# Altium project SPINNER_TWIN_STARS.PrjPcb
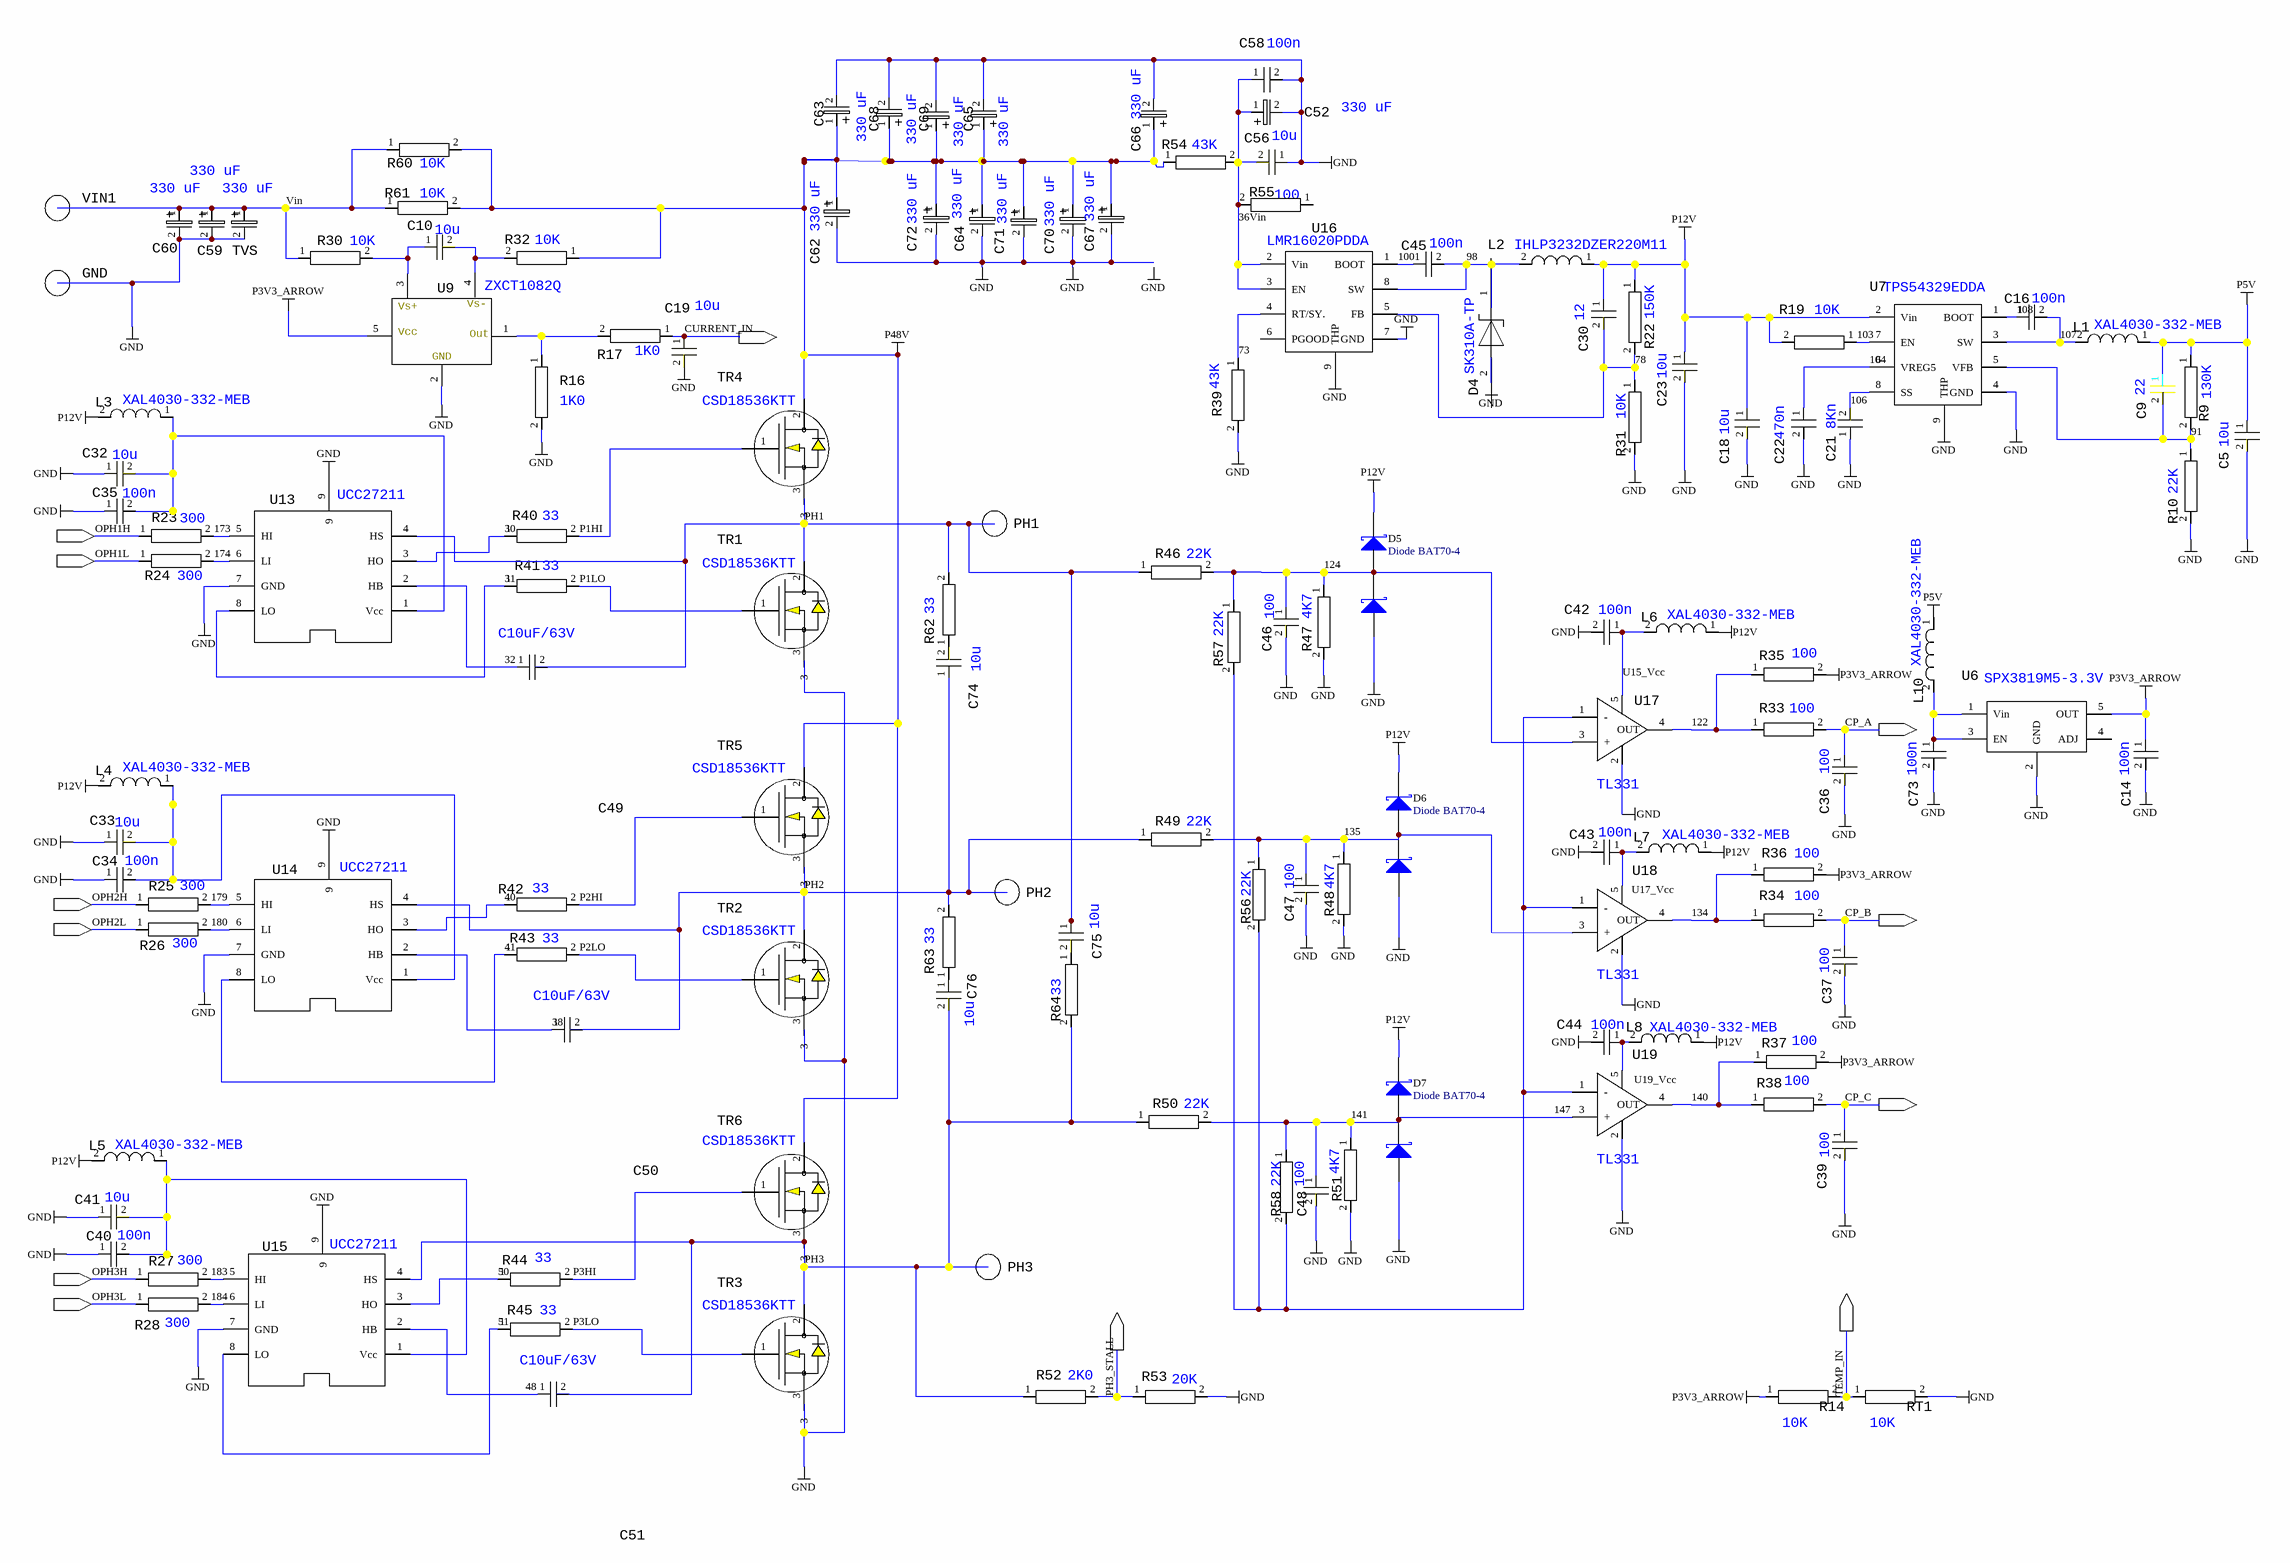
[diagram p0: POWER.SchDoc]
2 sheets, 226 parts. Net scope: global (net labels, ports and power ports of the same name join across sheets).
Board file: SPINNER_TWIN_STARS.PcbDoc
Sheets:
  POWER.SchDoc
  CONTROL.SchDoc

## Sheet POWER.SchDoc
size 533 x 330 mm

### Parts
(Parts that share a designator on the sheet are numbered #1, #2 ... from top to bottom, then left to right.)
?#1  SIGNALREF (externalout)  (value not drawn)  (graphical)
?#2  SIGNALREF (externalin)  (value not drawn)  (graphical)
?#3  SIGNALREF (externalin)  (value not drawn)  (graphical)
?#4  SIGNALREF (externalout)  (value not drawn)  (graphical)
?#5  SIGNALREF (externalin)  (value not drawn)  (graphical)
?#6  SIGNALREF (externalout)  (value not drawn)  (graphical)
?#7  SIGNALREF (externalin)  (value not drawn)  (graphical)
?#8  SIGNALREF (externalout)  (value not drawn)  (graphical)
?#9  SIGNALREF (externalin)  (value not drawn)  (graphical)
?#10  SIGNALREF (externalin)  (value not drawn)  (graphical)
?#11  SIGNALREF (externalout)  (value not drawn)  (graphical)
?#12  SIGNALREF (externalout)  (value not drawn)  (graphical)
C5  10u  [0805_N]
C9  22  [0805_N]
C10  10u  [0805_N]
C14  100n  [1608[0603]]
C16  100n  [1608[0603]]
C18  10u  [0805_N]
C19  10u  [0805_N]
C21  8Kn  [1608[0603]]
C22  470n  [0805_N]
C23  10u  [0805_N]
C30  12  [0805_N]
C32  10u  [0805_N]
C33  10u  [0805_N]
C34  100n  [1608[0603]]
C35  100n  [1608[0603]]
C36  100  [1608[0603]]
C37  100  [1608[0603]]
C39  100  [1608[0603]]
C40  100n  [1608[0603]]
C41  10u  [0805_N]
C42  100n  [1608[0603]]
C43  100n  [1608[0603]]
C44  100n  [1608[0603]]
C45  100n  [1608[0603]]
C46  100  [1608[0603]]
C47  100  [1608[0603]]
C48  100  [1608[0603]]
C49  C10uF/63V  [C1210_N]
C50  C10uF/63V  [C1210_N]
C51  C10uF/63V  [C1210_N]
C52  330 uF  [CAP  POLAR 10RM5 (wave)]
C56  10u  [0805_N]
C58  100n  [1608[0603]]
C59  330 uF  [CAP  POLAR 10RM5 (wave)]
C60  330 uF  [CAP  POLAR 10RM5 (wave)]
C62  330 uF  [CAP  POLAR 10RM5 (wave)]
C63  330 uF  [CAP  POLAR 10RM5 (wave)]
C64  330 uF  [CAP  POLAR 10RM5 (wave)]
C65  330 uF  [CAP  POLAR 10RM5 (wave)]
C66  330 uF  [CAP  POLAR 10RM5 (wave)]
C67  330 uF  [CAP  POLAR 10RM5 (wave)]
C68  330 uF  [CAP  POLAR 10RM5 (wave)]
C69  330 uF  [CAP  POLAR 10RM5 (wave)]
C70  330 uF  [CAP  POLAR 10RM5 (wave)]
C71  330 uF  [CAP  POLAR 10RM5 (wave)]
C72  330 uF  [CAP  POLAR 10RM5 (wave)]
C73  100n  [1608[0603]]
C74  10u  [0805_N]
C75  10u  [0805_N]
C76  10u  [0805_N]
D4  SK310A-TP
D5  Diode BAT70-4  [SOT-23_N]
D6  Diode BAT70-4  [SOT-23_N]
D7  Diode BAT70-4  [SOT-23_N]
GND  I-GAT 3.2/5 mm  [mec-hole3.2mm /5.0 MM]  (value not drawn)
L1  XAL4030-332-MEB
L2  IHLP3232DZER220M11  [3232DZ (3232)]
L3  XAL4030-332-MEB
L4  XAL4030-332-MEB
L5  XAL4030-332-MEB
L6  XAL4030-332-MEB
L7  XAL4030-332-MEB
L8  XAL4030-332-MEB
L10  XAL4030-332-MEB
PH1  I-GAT 3.2/5 mm  [mec-hole3.2mm /5.0 MM]  (value not drawn)
PH2  I-GAT 3.2/5 mm  [mec-hole3.2mm /5.0 MM]  (value not drawn)
PH3  I-GAT 3.2/5 mm  [mec-hole3.2mm /5.0 MM]  (value not drawn)
R9  130K  [1608[0603]]
R10  22K  [1608[0603]]
R14  10K  [1608[0603]]
R16  1K0  [1608[0603]]
R17  1K0  [1608[0603]]
R19  10K  [1608[0603]]
R22  150K  [1608[0603]]
R23  300  [1608[0603]]
R24  300  [1608[0603]]
R25  300  [1608[0603]]
R26  300  [1608[0603]]
R27  300  [1608[0603]]
R28  300  [1608[0603]]
R30  10K  [1608[0603]]
R31  10K  [1608[0603]]
R32  10K  [1608[0603]]
R33  100  [1608[0603]]
R34  100  [1608[0603]]
R35  100  [1608[0603]]
R36  100  [1608[0603]]
R37  100  [1608[0603]]
R38  100  [1608[0603]]
R39  43K  [1608[0603]]
R40  33  [0805_N]
R41  33  [0805_N]
R42  33  [0805_N]
R43  33  [0805_N]
R44  33  [0805_N]
R45  33  [0805_N]
R46  22K  [1608[0603]]
R47  4K7  [1608[0603]]
R48  4K7  [1608[0603]]
R49  22K  [1608[0603]]
R50  22K  [1608[0603]]
R51  4K7  [1608[0603]]
R52  2K0  [1608[0603]]
R53  20K  [1608[0603]]
R54  43K  [1608[0603]]
R55  100  [1608[0603]]
R56  22K  [1608[0603]]
R57  22K  [1608[0603]]
R58  22K  [1608[0603]]
R60  10K  [1608[0603]]
R61  10K  [1608[0603]]
R62  33  [0805_N]
R63  33  [0805_N]
R64  33  [0805_N]
RT1  10K  [1608[0603]]
TR1  CSD18536KTT  [TO-263 (D2PAK)]
TR2  CSD18536KTT  [TO-263 (D2PAK)]
TR3  CSD18536KTT  [TO-263 (D2PAK)]
TR4  CSD18536KTT  [TO-263 (D2PAK)]
TR5  CSD18536KTT  [TO-263 (D2PAK)]
TR6  CSD18536KTT  [TO-263 (D2PAK)]
TVS  330 uF  [CAP  POLAR 10RM5 (wave)]
U6  SPX3819M5-3.3V
U7  TPS54329EDDA  [S_SO8_POWER_PAD (wave)]
U9  ZXCT1082Q  [S_SOT23-5 (reflow)]
U13  UCC27211  [S_SO8_POWER_PAD (wave)]
U14  UCC27211  [S_SO8_POWER_PAD (wave)]
U15  UCC27211  [S_SO8_POWER_PAD (wave)]
U16  LMR16020PDDA  [S_SO8_POWER_PAD (wave)]
U17  TL331  [S_SOT23-5 (REFLOW)]
U18  TL331  [S_SOT23-5 (REFLOW)]
U19  TL331  [S_SOT23-5 (REFLOW)]
VIN1  I-GAT 3.2/5 mm  [mec-hole3.2mm /5.0 MM]  (value not drawn)

### Nets
GND: C5.2 C14.2 C18.2 C19.2 C21.1 C22.2 C23.2 C32.1 C33.1 C34.1 C35.1 C36.2 C37.2 C39.2 C40.1 C41.1 C42.2 C43.2 C44.2 C46.2 C47.2 C48.2 C52.2 C56.1 C58.2 C59.2 C60.2 C62.2 C63.2 C64.2 C65.2 C66.2 C67.2 C68.2 C69.2 C70.2 C71.2 C72.2 C73.2 D5.1(A) D6.1(A) D7.1(A) GND.1 R10.2 R16.2 R31.2 R39.2 R47.2 R48.2 R51.2 R53.2 RT1.2 TVS.2 U6.2(GND) U7.4(GND) U7.9(THP) U9.2 U13.7(GND) U13.9 U14.7(GND) U14.9 U15.7(GND) U15.9 U16.7(GND) U16.9(THP) U17.2(GND) U18.2(GND) U19.2(GND)
P3V3_ARROW: C14.1 R14.1 R35.2 R36.2 R37.2 U6.5(OUT) U9.5
P5V: C5.1 C9.1 L1.1 L10.1 R9.1
P12V: C18.1 C23.1 C30.1 D5.2(K) D6.2(K) D7.2(K) L2.1 L3.2 L4.2 L5.2 L6.1 L7.1 L8.1 R19.2 R22.1 U7.2(Vin)
P48V: C62.1 C63.1 C64.1 C65.1 C66.1 C67.1 C68.1 C69.1 C70.1 C71.1 C72.1 R32.1 R54.1 R60.2 R61.2 TR4.2 TR5.2 TR6.2
30: R40.1 U13.3(HO)
31: R41.1 U13.8(LO)
32: C49.1 U13.2(HB)
36Vin: C52.1 C56.2 C58.1 R54.2 R55.2 U16.2(Vin) U16.3(EN)
38: C50.1 U14.2(HB)
40: R42.1 U14.3(HO)
41: R43.1 U14.8(LO)
48: C51.1 U15.2(HB)
50: R44.1 U15.3(HO)
51: R45.1 U15.8(LO)
73: R39.1 U16.4(RT/SY.)
78: C30.2 R22.2 R31.1 U16.5(FB)
91: C9.2 R9.2 R10.1 U7.5(VFB)
98: C45.2 L2.2 U16.8(SW)
100: C45.1 U16.1(BOOT)
103: R19.1 U7.7(EN)
104: C22.1 U7.6(VREG5)
106: C21.2 U7.8(SS)
107: C16.2 L1.2 U7.3(SW)
108: C16.1 U7.1(BOOT)
122: R33.1 R35.1 U17.4(OUT)
124: C46.1 D5.3(KA) R46.2 R47.1 R57.1 U17.3(+)
134: R34.1 R36.1 U18.4(OUT)
135: C47.1 D6.3(KA) R48.1 R49.2 R56.1 U18.3(+)
140: R37.1 R38.1 U19.4(OUT)
141: C48.1 D7.3(KA) R50.2 R51.1 R58.1 U19.3(+)  [also labelled 147]
173: R23.2 U13.5(HI)
174: R24.2 U13.6(LI)
179: R25.2 U14.5(HI)
180: R26.2 U14.6(LI)
183: R27.2 U15.5(HI)
184: R28.2 U15.6(LI)
CP_A: ?#4.1 C36.1 R33.2
CP_B: ?#6.1 C37.1 R34.2
CP_C: ?#8.1 C39.1 R38.2
CURRENT_IN: ?#1.1 C19.1 R17.1
OPH1H: ?#2.1 R23.1
OPH1L: ?#3.1 R24.1
OPH2H: ?#5.1 R25.1
OPH2L: ?#7.1 R26.1
OPH3H: ?#9.1 R27.1
OPH3L: ?#10.1 R28.1
P1HI: R40.2 TR4.1
P1LO: R41.2 TR1.1
P2HI: R42.2 TR5.1
P2LO: R43.2 TR2.1
P3HI: R44.2 TR6.1
P3LO: R45.2 TR3.1
PH1: C49.2 C75.1 PH1.1 R46.1 R62.2 TR1.2 U13.4(HS)
PH2: C50.2 C74.1 PH2.1 R49.1 R63.2 TR2.2 U14.4(HS)
PH3: C51.2 C76.2 PH3.1 R50.1 R52.1 R64.2 TR3.2 U15.4(HS)
PH3_STALL: ?#12.1 R52.2 R53.1
TEMP_IN: ?#11.1 R14.2 RT1.1
U15_Vcc: C42.1 L6.2 U17.5(Vcc)
Vin: C59.1 C60.1 R30.1 R60.1 R61.1 TVS.1 VIN1.1
NetC10_1: C10.1 R30.2 U9.3
NetC10_2: C10.2 R32.2 U9.4
NetC32_2: C32.2 C35.2 L3.1 U13.1(Vcc)
NetC33_2: C33.2 C34.2 L4.1 U14.1(Vcc)
NetC40_2: C40.2 C41.2 L5.1 U15.1(Vcc)
NetC43_1: C43.1 L7.2 U18.5(Vcc)
NetC44_1: C44.1 L8.2 U19.5(Vcc)
NetC73_1: C73.1 L10.2 U6.1(Vin) U6.3(EN)
NetC74_2: C74.2 R62.1
NetC75_2: C75.2 R64.1
NetC76_1: C76.1 R63.1
NetR16_1: R16.1 R17.2 U9.1
NetR56_2: R56.2 R57.2 R58.2 U17.1(-) U18.1(-) U19.1(-)

Not connected (* = marked no-connect by the designer): D4 1 2; R55 1; TR1 3; TR2 3; TR3 3; TR4 3; TR5 3; TR6 3; U6 4(ADJ); U16 6(PGOOD)

### Notes on the sheet
- Labels drawn without touching a wire or pin: GND, U17_Vcc, U19_Vcc
- (in symbol ZXCT1082Q) Vs+; Vs-; Vcc; Out; GND

### Library data of the parts
C5 C10 C18 C19 C23 C32 C33 C41 C56 C74-C76 = C10u-10%-0805: 10u Surface mount CAP 0805 10% 25V; (OldCtfName): (CTF_OLD_NAME_INVALID); Value: 10u; Tolerance: 10%; Voltage: 25V
C9 = C22-10%-0805: 22p Surface mount CAP 10% 25V; (OldCtfName): (CTF_OLD_NAME_INVALID); Value: 22; Tolerance: 10%; Voltage: 25V
C14 C16 C34 C35 C40 C42-C45 C58 C73 = C100n-10%-0603: 100n Surface mount CAP 10% 25V; (OldCtfName): (CTF_OLD_NAME_INVALID); Value: 100n; Tolerance: 10%; Voltage: 25V
C21 = C8n2-10%-0603: 8n2 Surface mount CAP 10% 25V; (OldCtfName): (CTF_OLD_NAME_INVALID); Value: 8Kn; Tolerance: 10%; Voltage: 25V
C22 = C470n-10%-0805: 470n Surface mount CAP 10% 25V; (OldCtfName): (CTF_OLD_NAME_INVALID); Value: 470n; Tolerance: 10%; Voltage: 25V
C30 = C12-10%-0805: 12p Surface mount CAP 10% 25V; (OldCtfName): (CTF_OLD_NAME_INVALID); Value: 12; Tolerance: 10%; Voltage: 25V
C36 C37 C39 C46-C48 = C100-10%-0603: 100p Surface mount CAP 10% 25V; (OldCtfName): (CTF_OLD_NAME_INVALID); Value: 100; Tolerance: 10%; Voltage: 25V
C49-C51 = C10uF/63V-1210: SURFACE MOUNT CAPACITOR; Voltage: 63V; Tolerance: 20%; (OldCtfName): (CTF_OLD_NAME_INVALID); Value: C10uF/63V
C52 C59 C60 C62-C72 TVS = C330uF-63V--Polar: Voltage: 63V; Tolerance: 20%; (OldCtfName): (CTF_OLD_NAME_INVALID); Value: 330 uF
D4 = SK310A-TP: SHOTTKY DIODE 100V/3A; Manufacturer: MCC; (OldCtfName): (CTF_OLD_NAME_INVALID); Value: SK310A-TP
D5-D7 = Diode BAS70-04: Silicon RF Schottky Diode for Mixer Applications in the VHF/UHF Range; Note: Pin 2 is not connected and not drawn.; Published: 21-Mar-2003; LatestRevisionDate: 29-May-2009; LatestRevisionNote: IPC-7351 Footprint Added.; DatasheetVersion: Oct-1999; PackageVersion: Sep-2001; PackageReference: SOT-23; Publisher: Altium Limited; PackageDescription: 3-Pin SOT-23 Package 0.95 mm Pitch, 2.5 mm Lead Span; ComponentLink1Description: Manufacturer Link; ComponentLink1URL: http://www.infineon.com/; ComponentLink2Description: Datasheet; ComponentLink2URL: http://www.infineon.com/upload/Document/cmc_upload/documents/009/363/bat17series.pdf
GND PH1-PH3 VIN1 = I-GAT 3.2/5 mm: Hole Plated 3.2 mm x 5 mm; (OldCtfName): (CTF_OLD_NAME_INVALID)
L1 L3-L8 L10 = XAL4030-332-MEB: XAL4030-332-MEB - INDUCTOR 33 uH; Tolerance: 20%; (OldCtfName): (CTF_OLD_NAME_INVALID); Value: XAL4030-332-MEB; Elec_type: XAL4030-332-MEB
L2 = IHLP3232DZER220M11: IHLP3232DZER220M11- 22 uH; Tolerance: 20%; (OldCtfName): (CTF_OLD_NAME_INVALID); Value: IHLP3232DZER220M11; Elec_type: IHLP3232DZER220M11
R9 = R130K-1%-0805: 130K SMD 0805 1%; Wattage: 0.25W; (OldCtfName): (CTF_OLD_NAME_INVALID); Value: 130K; Tolerance: 1%
R10 R46 R49 R50 R56-R58 = R22K-1%-0603: 22K SMD 0603 1%; Wattage: 0.065W; (OldCtfName): (CTF_OLD_NAME_INVALID); Value: 22K; Tolerance: 1%
R14 R19 R30-R32 R60 R61 RT1 = R10K-1%-0603: 10K SMD 0603 1%; Wattage: 0.065W; (OldCtfName): (CTF_OLD_NAME_INVALID); Value: 10K; Tolerance: 1%
R16 R17 = R1K0-1%-0603: 1K0 SMD 0603 1%; Wattage: 0.065W; (OldCtfName): (CTF_OLD_NAME_INVALID); Value: 1K0; Tolerance: 1%
R22 = R150K-1%-0805: 150K SMD 0805 1%; Wattage: 0.25W; (OldCtfName): (CTF_OLD_NAME_INVALID); Value: 150K; Tolerance: 1%
R23-R28 = R300-1%-0603: 300R SMD 0603 1%; Wattage: 0.065W; (OldCtfName): (CTF_OLD_NAME_INVALID); Value: 300; Tolerance: 1%
R33-R38 R55 = R100-1%-0603: 100R SMD 0603 1%; Wattage: 0.065W; (OldCtfName): (CTF_OLD_NAME_INVALID); Value: 100; Tolerance: 1%
R39 R54 = R43K-1%-0603: 43K SMD 0603 1%; Wattage: 0.065W; (OldCtfName): (CTF_OLD_NAME_INVALID); Value: 43K; Tolerance: 1%
R40-R45 R62-R64 = R33-1%-0805: 33R SMD 0805 1%; Wattage: 0.25W; (OldCtfName): (CTF_OLD_NAME_INVALID); Value: 33; Tolerance: 1%
R47 R48 R51 = R4K7-1%-0603: 4K7 SMD 0603 1%; Wattage: 0.065W; (OldCtfName): (CTF_OLD_NAME_INVALID); Value: 4K7; Tolerance: 1%
R52 = R2K0-1%-0603: 2K0 SMD 0603 1%; Wattage: 0.065W; (OldCtfName): (CTF_OLD_NAME_INVALID); Value: 2K0; Tolerance: 1%
R53 = R20K-1%-0603: 20K SMD 0603 1%; Wattage: 0.065W; (OldCtfName): (CTF_OLD_NAME_INVALID); Value: 20K; Tolerance: 1%
TR1-TR6 = CSD18536KTT: N-CHANNEL MOSFET DPAK; Manufacturer: TI; (OldCtfName): (CTF_OLD_NAME_INVALID); Value: CSD18536KTT
U6 = SPX1819M5-3.3V: POS VOLTAGE REGULATOR FIXED 3.3V; Manufacturer: EXAR; (OldCtfName): (CTF_OLD_NAME_INVALID); Value: SPX3819M5-3.3V
U7 = TPS54329EDDA: POS STEP DOWN CONVERTER ADJUSTABLE; Manufacturer: TI; (OldCtfName): (CTF_OLD_NAME_INVALID); Value: TPS54329EDDA
U9 = ZXCT1082Q: CURRENT MIRROR ZXCT1082Q; Manufacturer: DIODES Inc; (OldCtfName): (CTF_OLD_NAME_INVALID); Value: ZXCT1082Q
U13-U15 = UCC27211: DOUBLE MOSFET DRIVED; Manufacturer: TI; (OldCtfName): (CTF_OLD_NAME_INVALID); Value: UCC27211
U16 = LMR16020PDDA: POS STEP DOWN CONVERTER ADJUSTABLE; Manufacturer: TI; (OldCtfName): (CTF_OLD_NAME_INVALID); Value: LMR16020PDDA
U17-U19 = TL331: RAIL-TO-RAIL COMPARATOR; Manufacturer: ANALOG DEVICES; (OldCtfName): (CTF_OLD_NAME_INVALID); Value: TL331

## Sheet CONTROL.SchDoc
size A3
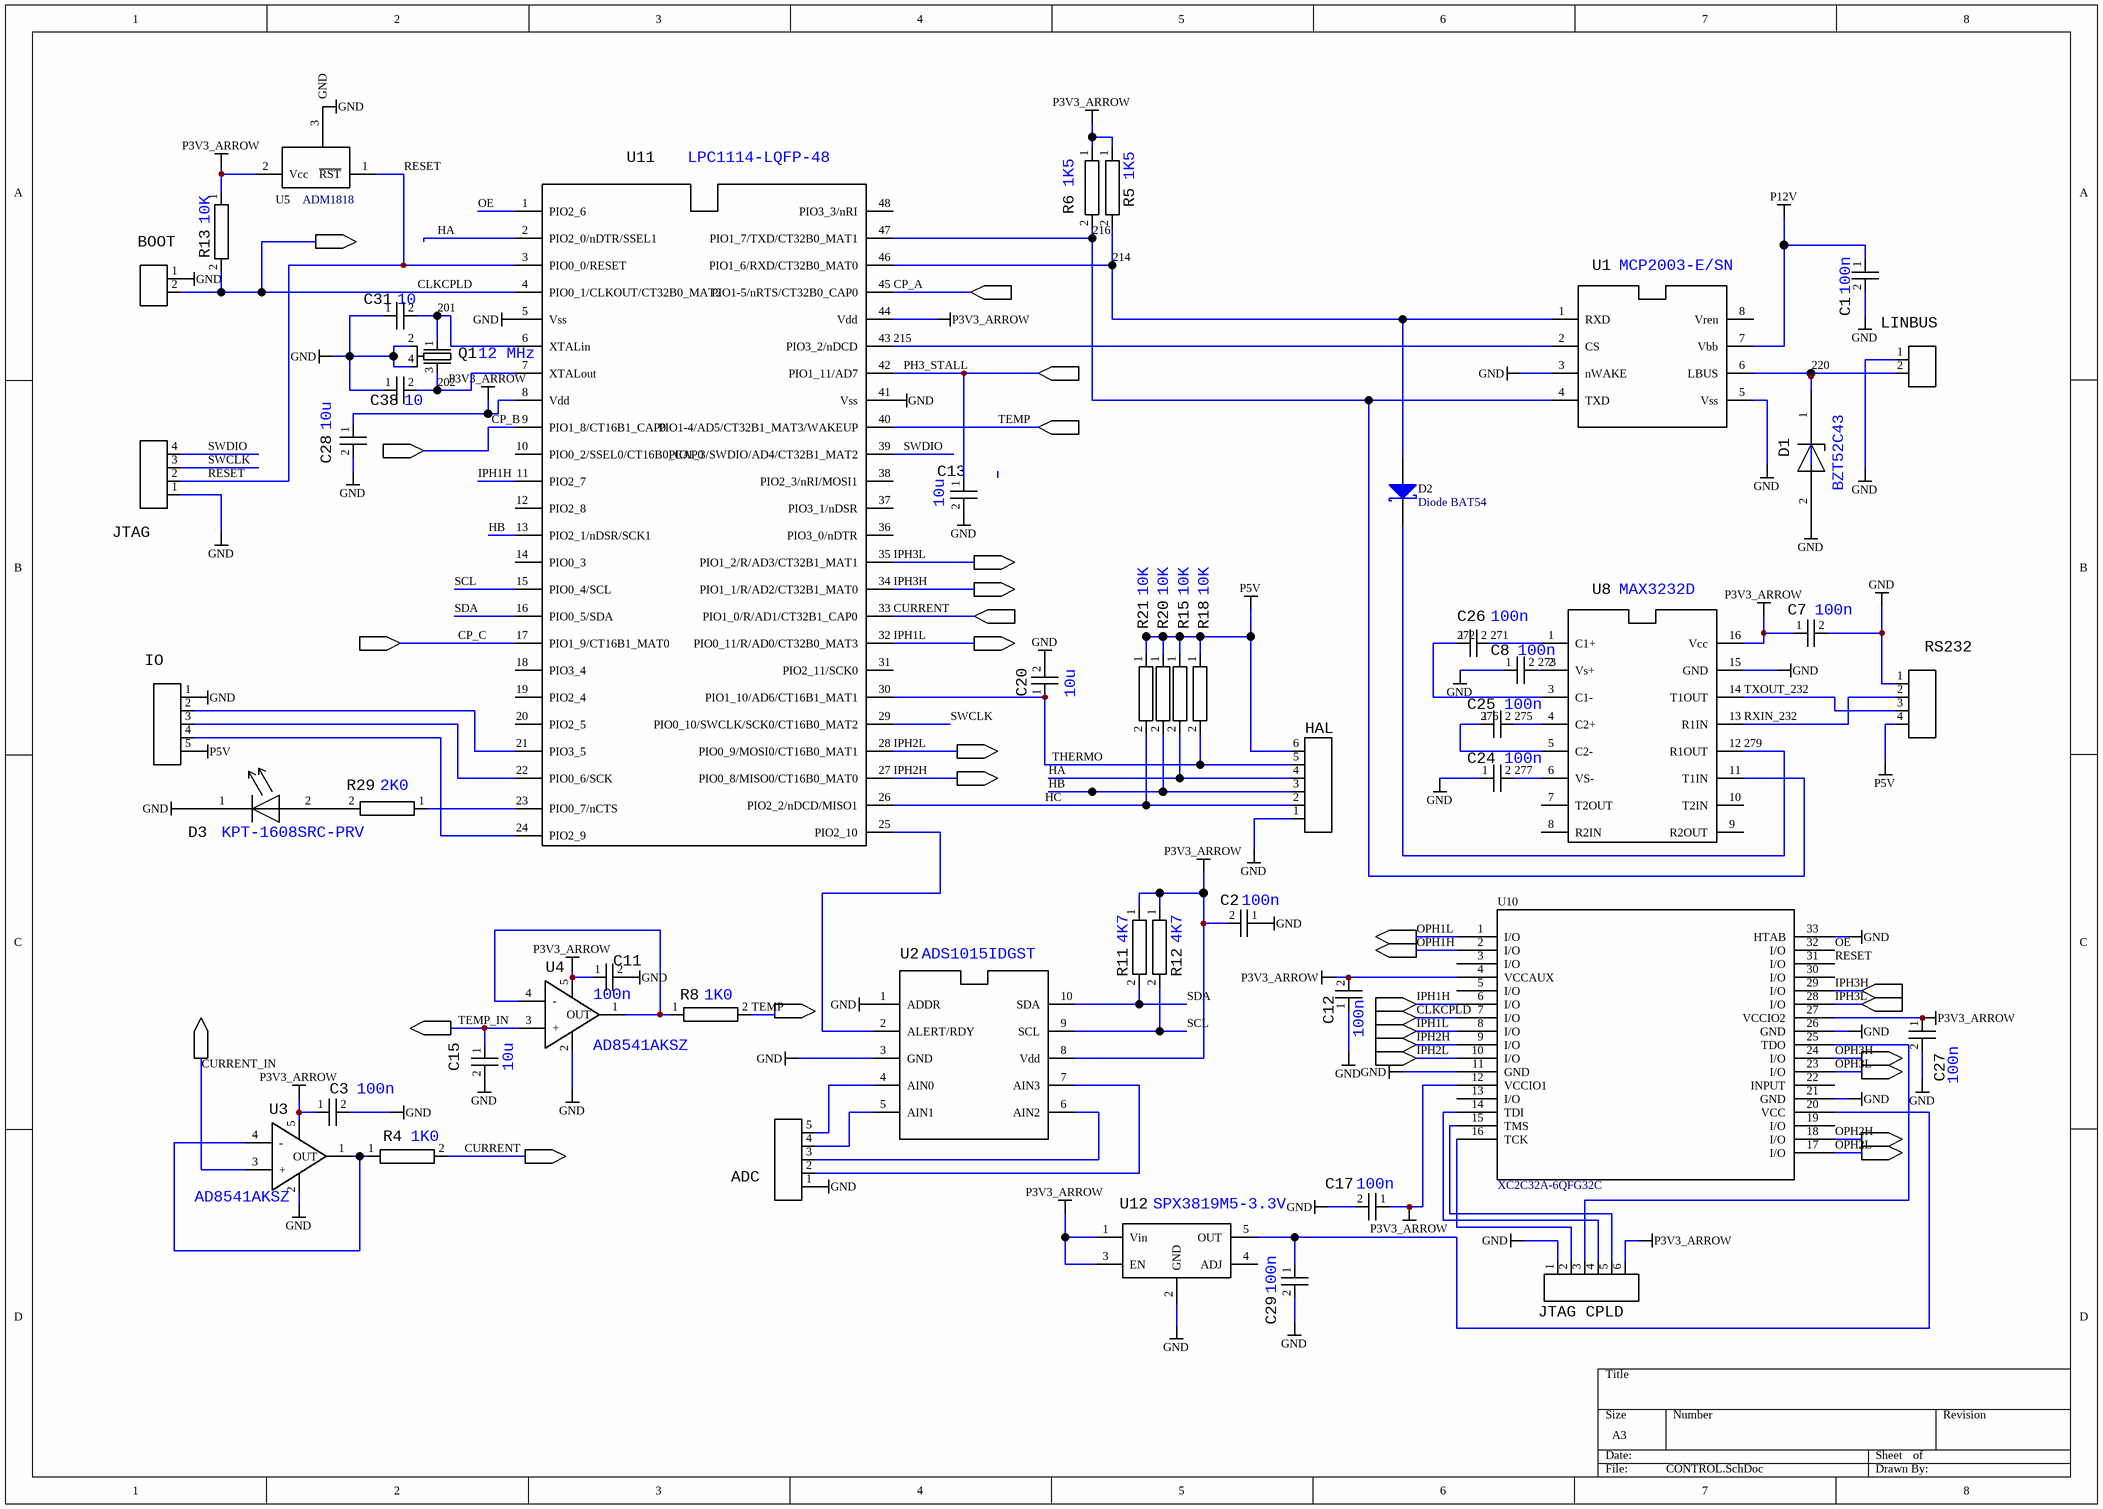
[diagram p1: CONTROL.SchDoc]

### Parts
(Parts that share a designator on the sheet are numbered #1, #2 ... from top to bottom, then left to right.)
?#13  SIGNALREF (externalout)  (value not drawn)  (graphical)
?#14  SIGNALREF (externalin)  (value not drawn)  (graphical)
?#15  SIGNALREF (externalin)  (value not drawn)  (graphical)
?#16  SIGNALREF (externalin)  (value not drawn)  (graphical)
?#17  SIGNALREF (externalin)  (value not drawn)  (graphical)
?#18  SIGNALREF (externalout)  (value not drawn)  (graphical)
?#19  SIGNALREF (externalout)  (value not drawn)  (graphical)
?#20  SIGNALREF (externalin)  (value not drawn)  (graphical)
?#21  SIGNALREF (externalin)  (value not drawn)  (graphical)
?#22  SIGNALREF (externalout)  (value not drawn)  (graphical)
?#23  SIGNALREF (externalout)  (value not drawn)  (graphical)
?#24  SIGNALREF (externalout)  (value not drawn)  (graphical)
?#25  SIGNALREF (externalin)  (value not drawn)  (graphical)
?#26  SIGNALREF (externalin)  (value not drawn)  (graphical)
?#27  SIGNALREF (externalin)  (value not drawn)  (graphical)
?#28  SIGNALREF (externalin)  (value not drawn)  (graphical)
?#29  SIGNALREF (externalin)  (value not drawn)  (graphical)
?#30  SIGNALREF (externalout)  (value not drawn)  (graphical)
?#31  SIGNALREF (externalin)  (value not drawn)  (graphical)
?#32  SIGNALREF (externalout)  (value not drawn)  (graphical)
?#33  SIGNALREF (externalin)  (value not drawn)  (graphical)
?#34  SIGNALREF (externalin)  (value not drawn)  (graphical)
?#35  SIGNALREF (externalout)  (value not drawn)  (graphical)
?#36  SIGNALREF (externalin)  (value not drawn)  (graphical)
?#37  SIGNALREF (externalin)  (value not drawn)  (graphical)
?#38  SIGNALREF (externalin)  (value not drawn)  (graphical)
?#39  SIGNALREF (externalin)  (value not drawn)  (graphical)
?#40  SIGNALREF (externalout)  (value not drawn)  (graphical)
?#41  SIGNALREF (externalin)  (value not drawn)  (graphical)
ADC  HEADER 5P S MALE  [CON-SRS-5-0254]  (value not drawn)
BOOT  HEADER 2P S MALE  [con-srs-2-0254]  (value not drawn)
C1  100n  [1608[0603]]
C2  100n  [1608[0603]]
C3  100n  [1608[0603]]
C7  100n  [1608[0603]]
C8  100n  [1608[0603]]
C11  100n  [1608[0603]]
C12  100n  [1608[0603]]
C13  10u  [0805_N]
C15  10u  [0805_N]
C17  100n  [1608[0603]]
C20  10u  [0805_N]
C24  100n  [1608[0603]]
C25  100n  [1608[0603]]
C26  100n  [1608[0603]]
C27  100n  [1608[0603]]
C28  10u  [0805_N]
C29  100n  [1608[0603]]
C31  10  [1608[0603]]
C38  10  [1608[0603]]
D1  BZT52C43  [SOD123]
D2  Diode BAT54  [SOT-23_N]
D3  KPT-1608SRC-PRV
HAL  HEADER 6P S MALE  [con-srs-6-0254]  (value not drawn)
IO  HEADER 5P S MALE  [CON-SRS-5-0254]  (value not drawn)
JTAG  HEADER 4P S MALE  [con-srs-4-0254]  (value not drawn)
JTAG_CPLD  HEADER 6P S MALE  [con-srs-6-0254]  (value not drawn)
LINBUS  HEADER 2P S MALE  [con-srs-2-0254]  (value not drawn)
Q1  12 MHz  [QUARTZ SMD QKT (QKT)]
R4  1K0  [1608[0603]]
R5  1K5  [1608[0603]]
R6  1K5  [1608[0603]]
R8  1K0  [1608[0603]]
R11  4K7  [1608[0603]]
R12  4K7  [1608[0603]]
R13  10K  [1608[0603]]
R15  10K  [1608[0603]]
R18  10K  [1608[0603]]
R20  10K  [1608[0603]]
R21  10K  [1608[0603]]
R29  2K0  [1608[0603]]
RS232  HEADER 4P S MALE  [con-srs-4-0254]  (value not drawn)
U1  MCP2003-E/SN
U2  ADS1015IDGST  [VSSOP-10 (GST)]
U3  AD8541AKSZ
U4  AD8541AKSZ
U5  ADM1818  [SOT-23_N]
U8  MAX3232D
U10  XC2C32A-6QFG32C  [32-QFN]
U11  LPC1114-LQFP-48  [LQFP48_N]
U12  SPX3819M5-3.3V

### Nets
GND: ADC.1 BOOT.1 C1.2 C2.1 C3.2 C7.2 C8.1 C11.2 C12.1 C13.2 C15.2 C17.2 C20.2 C24.1 C27.2 C28.2 C29.2 C31.1 C38.1 D3.1 HAL.1 IO.1 JTAG.1 JTAG_CPLD.1 LINBUS.1 Q1.2 Q1.4 RS232.1 U1.3(nWAKE) U1.5(Vss) U2.1(ADDR) U2.3(GND) U3.2(GND) U4.2(GND) U8.15(GND) U10.11(GND) U10.21(GND) U10.26(GND) U10.33(HTAB) U11.5(Vss) U11.41(Vss) U12.2(GND)
P3V3_ARROW: C2.2 C3.1 C7.1 C11.1 C12.2 C17.1 C27.1 C28.1 JTAG_CPLD.6 R5.1 R6.1 R11.1 R12.1 R13.1 U2.8(Vdd) U3.5(Vcc) U4.5(Vcc) U5.2(Vcc) U8.16(Vcc) U10.4(VCCAUX) U10.12(VCCIO1) U10.27(VCCIO2) U11.8(Vdd) U11.44(Vdd) U12.1(Vin) U12.3(EN)
P5V: HAL.6 IO.5 R15.1 R18.1 R20.1 R21.1 RS232.4
P12V: C1.1 U1.7(Vbb)
201: C31.2 Q1.1 U11.6(XTALin)
202: C38.2 Q1.3 U11.7(XTALout)
214: D2.1(A) R5.2 U1.1(RXD) U11.46(PIO1_6/RXD/CT32B0_MAT0)
215: U1.2(CS) U11.43(PIO3_2/nDCD)
216: R6.2 U1.4(TXD) U8.11(T1IN) U11.47(PIO1_7/TXD/CT32B0_MAT1)
220: D1.1 LINBUS.2 U1.6(LBUS)
271: C26.2 U8.1(C1+)
272: C26.1 U8.3(C1-)
273: C8.2 U8.2(Vs+)
275: C25.2 U8.4(C2+)
276: C25.1 U8.5(C2-)
277: C24.2 U8.6(VS-)
279: D2.3(K) U8.12(R1OUT)
CLKCPLD: ?#13.1 ?#31.1 BOOT.2 R13.2 U10.7(I/O) U11.4(PIO0_1/CLKOUT/CT32B0_MAT2)
CP_A: ?#14.1 U11.45(PIO1-5/nRTS/CT32B0_CAP0)
CP_B: ?#17.1 U11.9(PIO1_8/CT16B1_CAP0)
CP_C: ?#21.1 U11.17(PIO1_9/CT16B1_MAT0)
CURRENT: ?#20.1 ?#40.1 R4.2 U11.33(PIO1_0/R/AD1/CT32B1_CAP0)
CURRENT_IN: ?#35.1 U3.3(+)
HA: HAL.4 R15.2 U11.2(PIO2_0/nDTR/SSEL1)
HB: HAL.3 R20.2 U11.13(PIO2_1/nDSR/SCK1)
HC: HAL.2 R21.2 U11.26(PIO2_2/nDCD/MISO1)
IPH1H: ?#28.1 U10.6(I/O) U11.11(PIO2_7)
IPH1L: ?#22.1 ?#33.1 U10.8(I/O) U11.32(PIO0_11/R/AD0/CT32B0_MAT3)
IPH2H: ?#24.1 ?#34.1 U10.9(I/O) U11.27(PIO0_8/MISO0/CT16B0_MAT0)
IPH2L: ?#23.1 ?#36.1 U10.10(I/O) U11.28(PIO0_9/MOSI0/CT16B0_MAT1)
IPH3H: ?#19.1 ?#27.1 U10.29(I/O) U11.34(PIO1_1/R/AD2/CT32B1_MAT0)
IPH3L: ?#18.1 ?#29.1 U10.28(I/O) U11.35(PIO1_2/R/AD3/CT32B1_MAT1)
OE: U10.32(I/O) U11.1(PIO2_6)
OPH1H: U10.2(I/O)
OPH1L: U10.1(I/O)
OPH2H: U10.18(I/O)
OPH2L: U10.17(I/O)
OPH3H: U10.24(I/O)
OPH3L: U10.23(I/O)
PH3_STALL: ?#15.1 C13.1 U11.42(PIO1_11/AD7)
RESET: JTAG.2 U5.1(~{RST}) U10.31(I/O) U11.3(PIO0_0/RESET)
RXIN_232: RS232.2 U8.13(R1IN)
SCL: R12.2 U2.9(SCL) U11.15(PIO0_4/SCL)
SDA: R11.2 U2.10(SDA) U11.16(PIO0_5/SDA)
SWCLK: JTAG.3 U11.29(PIO0_10/SWCLK/SCK0/CT16B0_MAT2)
SWDIO: JTAG.4 U11.39(PIO1_3/SWDIO/AD4/CT32B1_MAT2)
TEMP: ?#16.1 ?#30.1 R8.2 U11.40(PIO1-4/AD5/CT32B1_MAT3/WAKEUP)
TEMP_IN: ?#32.1 C15.1 U4.3(+)
THERMO: C20.1 HAL.5 R18.2 U11.30(PIO1_10/AD6/CT16B1_MAT1)
TXOUT_232: RS232.3 U8.14(T1OUT)
NetADC_2: ADC.2 U2.7(AIN3)
NetADC_3: ADC.3 U2.6(AIN2)
NetADC_4: ADC.4 U2.5(AIN1)
NetADC_5: ADC.5 U2.4(AIN0)
NetC29_1: C29.1 U10.20(VCC) U12.5(OUT)
NetD3_2: D3.2 R29.2
NetIO_2: IO.2 U11.21(PIO3_5)
NetIO_3: IO.3 U11.22(PIO0_6/SCK)
NetIO_4: IO.4 U11.24(PIO2_9)
NetJTAG_CPLD_2: JTAG_CPLD.2 U10.16(TCK)
NetJTAG_CPLD_3: JTAG_CPLD.3 U10.25(TDO)
NetJTAG_CPLD_4: JTAG_CPLD.4 U10.14(TDI)
NetJTAG_CPLD_5: JTAG_CPLD.5 U10.15(TMS)
NetR4_1: R4.1 U3.1(OUT) U3.4(-)
NetR8_1: R8.1 U4.1(OUT) U4.4(-)
NetR29_1: R29.1 U11.23(PIO0_7/nCTS)
NetU2_2: U2.2(ALERT/RDY) U11.25(PIO2_10)

Not connected (* = marked no-connect by the designer): ?#25 1; ?#26 1; ?#37 1; ?#38 1; ?#39 1; ?#41 1; D1 2; U1 8(Vren); U5 3(GND); U8 7(T2OUT) 8(R2IN) 9(R2OUT) 10(T2IN); U10 3(I/O) 5(I/O) 13(I/O) 19(I/O) 22(INPUT) 30(I/O); U11 10(PIO0_2/SSEL0/CT16B0_CAP0) 12(PIO2_8) 14(PIO0_3) 18(PIO3_4) 19(PIO2_4) 20(PIO2_5) 31(PIO2_11/SCK0) 36(PIO3_0/nDTR) 37(PIO3_1/nDSR) 38(PIO2_3/nRI/MOSI1) 48(PIO3_3/nRI); U12 4(ADJ)

### Notes on the sheet
- Labels drawn without touching a wire or pin: GND

### Library data of the parts
ADC IO = HEADER 5P S MALE: HEADER SINGLE ROW 4P STRAIGHT MALE; Elec_type: ON_BOARD_CONNECTOR; (OldCtfName): (CTF_OLD_NAME_INVALID)
BOOT LINBUS = HEADER 2P S MALE: HEADER SINGLE ROW 2P STRAIGHT MALE; Elec_type: ON_BOARD_CONNECTOR; (OldCtfName): (CTF_OLD_NAME_INVALID)
C1-C3 C7 C8 C11 C12 C17 C24-C27 C29 = C100n-10%-0603: as C14 on sheet POWER; Value: 100n; Tolerance: 10%; Voltage: 25V
C13 C15 C20 C28 = C10u-10%-0805: as C5 on sheet POWER; Value: 10u; Tolerance: 10%; Voltage: 25V
C31 C38 = C10-10%-0603: 10p Surface mount CAP 10% 25V; (OldCtfName): (CTF_OLD_NAME_INVALID); Value: 10; Tolerance: 10%; Voltage: 25V
D1 = BZT52C43: ZENER DIODE 43V; Manufacturer: DIODES; (OldCtfName): (CTF_OLD_NAME_INVALID); Value: BZT52C43
D2 = Diode BAT17: Silicon RF Schottky Diode for Mixer Applications in the VHF/UHF Range; Note: Pin 2 is not connected and not drawn.; Published: 21-Mar-2003; LatestRevisionDate: 29-May-2009; LatestRevisionNote: IPC-7351 Footprint Added.; DatasheetVersion: Oct-1999; PackageVersion: Sep-2001; PackageReference: SOT-23; Publisher: Altium Limited; PackageDescription: 3-Pin SOT-23 Package 0.95 mm Pitch, 2.5 mm Lead Span; ComponentLink1Description: Manufacturer Link; ComponentLink1URL: http://www.infineon.com/; ComponentLink2Description: Datasheet; ComponentLink2URL: http://www.infineon.com/upload/Document/cmc_upload/documents/009/363/bat17series.pdf
D3 = KPT-1608SRC-PRV: LED SMD RED        0603; Manufacturer: KINGBRIGHT; (OldCtfName): (CTF_OLD_NAME_INVALID); Value: KPT-1608SRC-PRV
HAL JTAG_CPLD = HEADER 6P S MALE: HEADER SINGLE ROW 6P STRAIGHT MALE; Elec_type: ON_BOARD_CONNECTOR; (OldCtfName): (CTF_OLD_NAME_INVALID)
JTAG RS232 = HEADER 4P S MALE: HEADER SINGLE ROW 4P STRAIGHT MALE; Elec_type: ON_BOARD_CONNECTOR; (OldCtfName): (CTF_OLD_NAME_INVALID)
Q1 = Q-12MHz-QKT_SMD: Quartz resonator QKT SMD case; (OldCtfName): (CTF_OLD_NAME_INVALID); Value: 12 MHz
R4 R8 = R1K0-1%-0603: as R16 on sheet POWER; Value: 1K0; Tolerance: 1%
R5 R6 = R1K5-1%-0805: 1K5 SMD 0805 1%; Wattage: 0.25W; (OldCtfName): (CTF_OLD_NAME_INVALID); Value: 1K5; Tolerance: 1%
R11 R12 = R4K7-1%-0603: as R47 on sheet POWER; Value: 4K7; Tolerance: 1%
R13 R15 R18 R20 R21 = R10K-1%-0603: as R14 on sheet POWER; Value: 10K; Tolerance: 1%
R29 = R2K0-1%-0603: as R52 on sheet POWER; Value: 2K0; Tolerance: 1%
U1 = MCP2003-E/SN: LIN DRIVER; Manufacturer: MICROCHIP; (OldCtfName): (CTF_OLD_NAME_INVALID); Value: MCP2003-E/SN
U2 = ADS1015IDGST: 4 CHAN AD CONVERTER; Manufacturer: TI; (OldCtfName): (CTF_OLD_NAME_INVALID); Value: ADS1015IDGST
U3 U4 = AD8541AKSZ: RAIL-TO-RAIL OPERATIONAL AMP; Manufacturer: ANALOG DEVICES; (OldCtfName): (CTF_OLD_NAME_INVALID); Value: AD8541AKSZ
U5 = ADM1818: MCU Reset IC; Note: Pin 2 is not connected and not drawn.; PackageVersion: Sep-2001; PackageReference: SOT-23; PackageDescription: 3-Pin SOT-23 Package 0.95 mm Pitch, 2.5 mm Lead Span; Published: 21-Mar-2003; LatestRevisionDate: 29-May-2009; LatestRevisionNote: IPC-7351 Footprint Added.; DatasheetVersion: Oct-1999
U8 = MAX232D: RS-232 TRANSCEIVER; Manufacturer: TEXAS; thm_power_diss: 0.2275; (OldCtfName): (CTF_OLD_NAME_INVALID); Value: MAX3232D
U10 = XC2C32A-6QFG32C: Imported; Vendor: Xilinx Inc; Programmable_Type: In System Programmable; Number_of_Macrocells: 32; Number_of_I_/O: 21; Operating_Temperature: 0Â°C ~ 70Â°C; Names_Registered_&amp;_Trademark_Names: CoolRunner II; Voltage: 1.8V; Memory_Type: CMOS; Delay_Time_tpd(1)_Max: 5.5ns; Voltage_Supply_-_Internal: 1.7 V ~ 1.9 V; Number_of_Logic_Elements/Blocks: 2; Number_of_Gates: 750; Mounting_Type: Surface Mount; C: Copyright (C) 2015 Accelerated Designs. All rights reserved; DigiKeyPartNumber: 122-1412-ND; Manufacturer_Part_Number: XC2C32A-6QFG32C; Quantity_Available: 6031; Copyright: Copyright (C) 2015 Accelerated Designs. All rights reserved; DataSheet: http://www.xilinx.com/support/documentation/data_sheets/ds310.pdf; Number_of_Logic_Blocks/Elements: -; Package_/_Case: 32-VFQFN Exposed Pad; Features: Programmable; Packaging: Tray; Names,_Registered_&amp;_Trademark_Names: CoolRunner II; Supplier_Device_Package: 32-QFN Exposed Pad (5x5); Value: Value; Type: Type; RefDes: RefDes
U11 = LPC1114-LQFP-48: NXP ARM 32BIT MPU; (OldCtfName): (CTF_OLD_NAME_INVALID); Value: LPC1114-LQFP-48; Manufacturer: NXP
U12 = SPX1819M5-3.3V: as U6 on sheet POWER; Value: SPX3819M5-3.3V

## Nets that join several sheets
GND: POWER (68 pins), CONTROL (42 pins)
P3V3_ARROW: POWER (7 pins), CONTROL (26 pins)
P5V: POWER (5 pins), CONTROL (7 pins)
P12V: POWER (16 pins), CONTROL (C1.1 U1.7)
CP_A: POWER (?#4.1 C36.1 R33.2), CONTROL (?#14.1 U11.45)
CP_B: POWER (?#6.1 C37.1 R34.2), CONTROL (?#17.1 U11.9)
CP_C: POWER (?#8.1 C39.1 R38.2), CONTROL (?#21.1 U11.17)
CURRENT_IN: POWER (?#1.1 C19.1 R17.1), CONTROL (?#35.1 U3.3)
OPH1H: POWER (?#2.1 R23.1), CONTROL (U10.2)
OPH1L: POWER (?#3.1 R24.1), CONTROL (U10.1)
OPH2H: POWER (?#5.1 R25.1), CONTROL (U10.18)
OPH2L: POWER (?#7.1 R26.1), CONTROL (U10.17)
OPH3H: POWER (?#9.1 R27.1), CONTROL (U10.24)
OPH3L: POWER (?#10.1 R28.1), CONTROL (U10.23)
PH3_STALL: POWER (?#12.1 R52.2 R53.1), CONTROL (?#15.1 C13.1 U11.42)
TEMP_IN: POWER (?#11.1 R14.2 RT1.1), CONTROL (?#32.1 C15.1 U4.3)